# EAGLE schematic esp-module-ou (EAGLE 9.6.2)
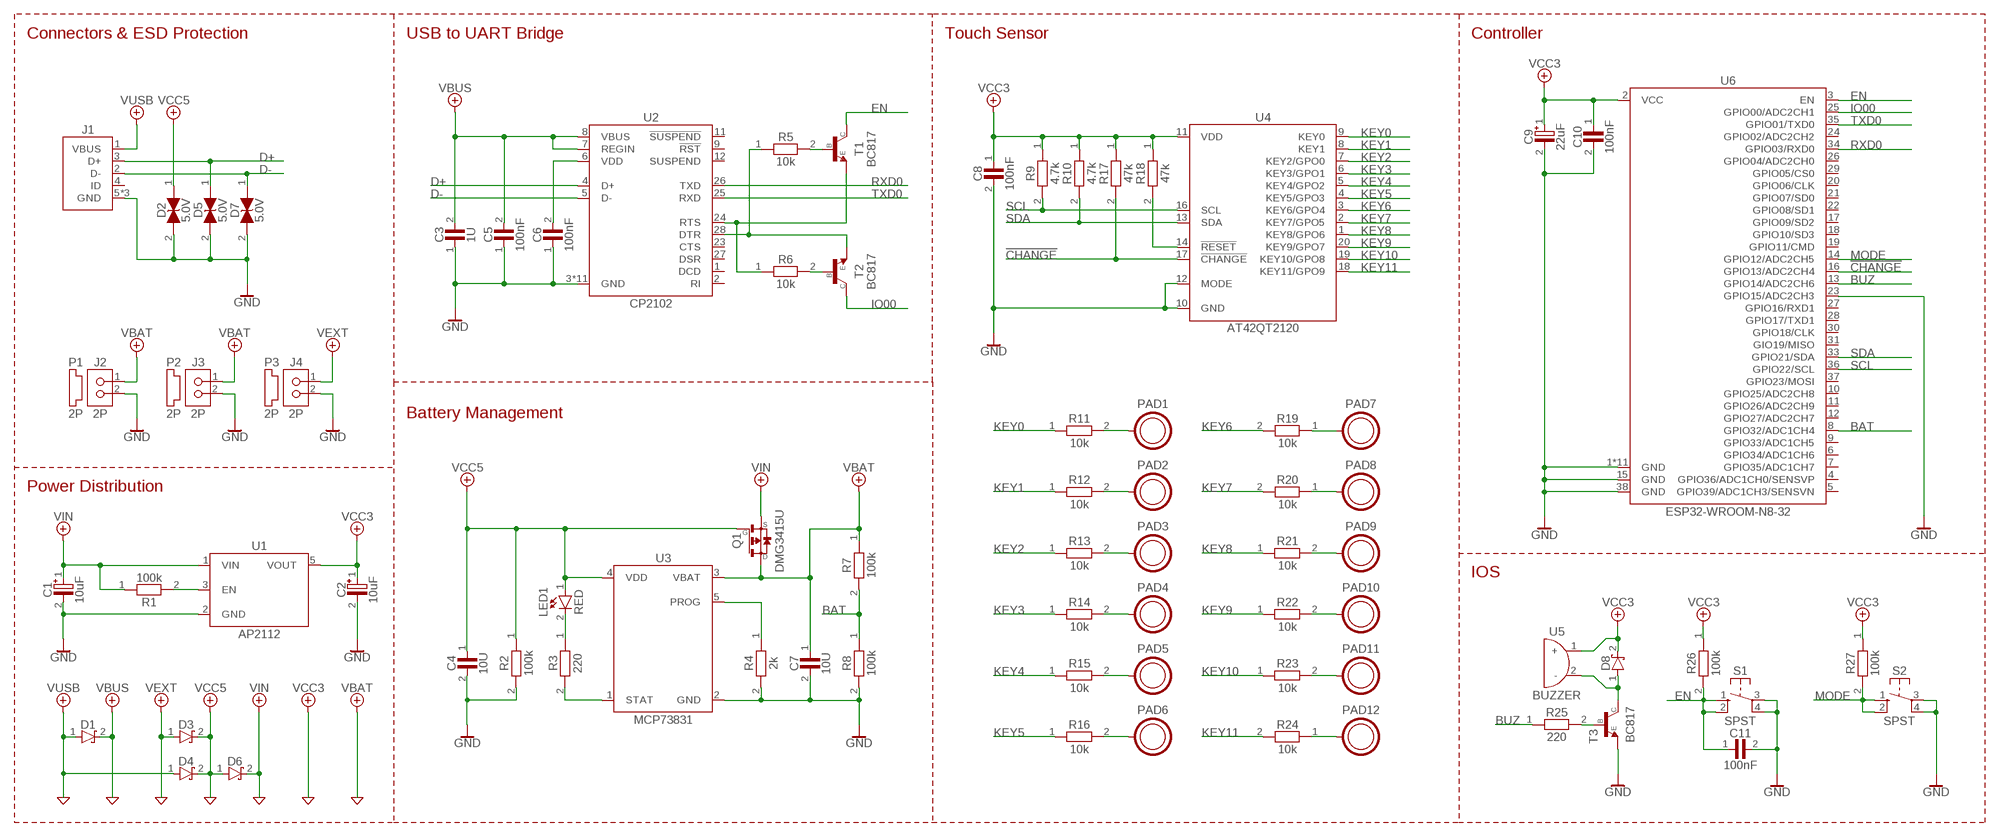
[diagram p0: schematic, sheet 1]

## Parts
C1  10uF  CAPACITOR-TANTALUM-10U-I1206-M3216  [I1206-M3216-D]
C2  10uF  CAPACITOR-TANTALUM-10U-I1206-M3216  [I1206-M3216-D]
C3  1U  CAPACITOR-CERAMIC-1U-I0805-M2012  [I0805-M2012-C]
C4  10U  CAPACITOR-CERAMIC-10U-I0805-M2012  [I0805-M2012-C]
C5  100nF  CAPACITOR-CERAMIC-100N-I0805-M2012  [I0805-M2012-C]
C6  100nF  CAPACITOR-CERAMIC-100N-I0805-M2012  [I0805-M2012-C]
C7  10U  CAPACITOR-CERAMIC-10U-I0805-M2012  [I0805-M2012-C]
C8  100nF  CAPACITOR-CERAMIC-100N-I0805-M2012  [I0805-M2012-C]
C9  22uF  CAPACITOR-TANTALUM-22U-I1206-M3216  [I1206-M3216-D]
C10  100nF  CAPACITOR-CERAMIC-100N-I0805-M2012  [I0805-M2012-C]
C11  100nF  CAPACITOR-CERAMIC-100N-I0805-M2012  [I0805-M2012-C]
D1  30V  SCHOTTKY-30V-SOD-323  [SOD-323]
D2  5.0V  ZENER-BI-5.0V-SOD-523  [SOD-523]
D3  30V  SCHOTTKY-30V-SOD-323  [SOD-323]
D4  30V  SCHOTTKY-30V-SOD-323  [SOD-323]
D5  5.0V  ZENER-BI-5.0V-SOD-523  [SOD-523]
D6  30V  SCHOTTKY-30V-SOD-323  [SOD-323]
D7  5.0V  ZENER-BI-5.0V-SOD-523  [SOD-523]
D8  30V  SCHOTTKY-30V-SOD-323  [SOD-323]
J1  USB-A-MICRO-TOP  [USB-A-MICRO-TOP]
J2  2P  HEADER-02P-1R-S2B-PH-SM4-TB  [JST-S2B-PH-SM4-TB]
J3  2P  HEADER-02P-1R-S2B-PH-SM4-TB  [JST-S2B-PH-SM4-TB]
J4  2P  HEADER-02P-1R-S2B-PH-SM4-TB  [JST-S2B-PH-SM4-TB]
LED1  RED  LED-RED-I0805-M2012  [I0805-M2012-D]
P1  2P  CONNECTOR-02P-1R-PHR  [CONNECTOR-DEFAULT]
P2  2P  CONNECTOR-02P-1R-PHR  [CONNECTOR-DEFAULT]
P3  2P  CONNECTOR-02P-1R-PHR  [CONNECTOR-DEFAULT]
PAD1  QTOUCH  [QTOUCH]
PAD2  QTOUCH  [QTOUCH]
PAD3  QTOUCH  [QTOUCH]
PAD4  QTOUCH  [QTOUCH]
PAD5  QTOUCH  [QTOUCH]
PAD6  QTOUCH  [QTOUCH]
PAD7  QTOUCH  [QTOUCH]
PAD8  QTOUCH  [QTOUCH]
PAD9  QTOUCH  [QTOUCH]
PAD10  QTOUCH  [QTOUCH]
PAD11  QTOUCH  [QTOUCH]
PAD12  QTOUCH  [QTOUCH]
Q1  DMG3415U  MOSFET-P-CHANNEL-20V-4A-SOT-23-3  [SOT-23-3]
R1  100k  RESISTOR-100K-I0805-M2012  [I0805-M2012-R]
R2  100k  RESISTOR-100K-I0805-M2012  [I0805-M2012-R]
R3  220  RESISTOR-220-I0805-M2012  [I0805-M2012-R]
R4  2k  RESISTOR-2K-I0805-M2012  [I0805-M2012-R]
R5  10k  RESISTOR-10K-I0805-M2012  [I0805-M2012-R]
R6  10k  RESISTOR-10K-I0805-M2012  [I0805-M2012-R]
R7  100k  RESISTOR-100K-I0805-M2012  [I0805-M2012-R]
R8  100k  RESISTOR-100K-I0805-M2012  [I0805-M2012-R]
R9  4.7k  RESISTOR-4.7K-I0805-M2012  [I0805-M2012-R]
R10  4.7k  RESISTOR-4.7K-I0805-M2012  [I0805-M2012-R]
R11  10k  RESISTOR-10K-I0805-M2012  [I0805-M2012-R]
R12  10k  RESISTOR-10K-I0805-M2012  [I0805-M2012-R]
R13  10k  RESISTOR-10K-I0805-M2012  [I0805-M2012-R]
R14  10k  RESISTOR-10K-I0805-M2012  [I0805-M2012-R]
R15  10k  RESISTOR-10K-I0805-M2012  [I0805-M2012-R]
R16  10k  RESISTOR-10K-I0805-M2012  [I0805-M2012-R]
R17  47k  RESISTOR-47K-I0805-M2012  [I0805-M2012-R]
R18  47k  RESISTOR-47K-I0805-M2012  [I0805-M2012-R]
R19  10k  RESISTOR-10K-I0805-M2012  [I0805-M2012-R]
R20  10k  RESISTOR-10K-I0805-M2012  [I0805-M2012-R]
R21  10k  RESISTOR-10K-I0805-M2012  [I0805-M2012-R]
R22  10k  RESISTOR-10K-I0805-M2012  [I0805-M2012-R]
R23  10k  RESISTOR-10K-I0805-M2012  [I0805-M2012-R]
R24  10k  RESISTOR-10K-I0805-M2012  [I0805-M2012-R]
R25  220  RESISTOR-220-I0805-M2012  [I0805-M2012-R]
R26  100k  RESISTOR-100K-I0805-M2012  [I0805-M2012-R]
R27  100k  RESISTOR-100K-I0805-M2012  [I0805-M2012-R]
S1  SPST  SWITCH-12V-50MA  [SMD-SW-4]
S2  SPST  SWITCH-12V-50MA  [SMD-SW-4]
T1  BC817  TRANSISTOR-NPN-SOT-23-3  [SOT-23-3]
T2  BC817  TRANSISTOR-NPN-SOT-23-3  [SOT-23-3]
T3  BC817  TRANSISTOR-NPN-SOT-23-3  [SOT-23-3]
U1  AP2112  AP2112-SOT-25-5  [SOT-25-5]
U2  CP2102  CP2102-QFN-28  [QFN-28]
U3  MCP73831  MCP73831-SOT-23-5  [SOT-23-5]
U4  AT42QT2120  AT42QT2120-TSSOP-20  [TSSOP-20]
U5  BUZZER  [SMD-BUZZER]
U6  ESP32-WROOM-N8-32  [ESP32-WROOM-32]

## Nets
!CHANGE: R17.2 U4.17(!CHANGE) U6.16(GPIO13/ADC2CH4)
!RESET: R18.2 U4.14(!RESET)
APEN: R1.2 U1.3(EN)
BAT: R7.2 R8.1 U6.8(GPIO32/ADC1CH4)
BUZ: R25.1 U6.13(GPIO14/ADC2CH6)
BZB: R25.2 T3.1(B)
BZC: D8.1(A) T3.3(C) U5.2(-)
D+: D5.1(A) J1.3(D+) U2.4(D+)
D-: D7.1(A) J1.2(D-) U2.5(D-)
DTR: R5.1 T2.2(E) U2.28(DTR)
DTRT: R5.2 T1.1(B)
EN: C11.1 R26.2 S1.1 S1.2 T1.3(C) U6.3(EN)
GND: C1.2(-) C2.2(-) C3.1 C4.2 C5.1 C6.1 C7.2 C8.2 C9.2(-) C10.2 C11.2 D2.2(C) D5.2(C) D7.2(C) J1.5(GND) J1.6(GND) J1.7(GND) J2.2 J3.2 J4.2 R2.2 R4.2 R8.2 S1.3 S1.4 S2.3 S2.4 T3.2(E) U1.2(GND) U2.3(GND) U2.29(GND) U2.30(GND) U2.31(GND) U2.32(GND) U2.33(GND) U2.34(GND) U2.35(GND) U2.36(GND) U2.37(GND) U2.38(GND) U3.2(GND) U4.10(GND) U4.12(MODE) U6.1(GND) U6.15(GND) U6.23(GPIO15/ADC2CH3) U6.38(GND) U6.39(GND) U6.40(GND) U6.41(GND) U6.42(GND) U6.43(GND) U6.44(GND) U6.45(GND) U6.46(GND) U6.47(GND) U6.48(GND)
IO00: T2.3(C) U6.25(GPIO00/ADC2CH1)
KEY0: R11.1 U4.9(KEY0)
KEY1: R12.1 U4.8(KEY1)
KEY2: R13.1 U4.7(KEY2/GPO0)
KEY3: R14.1 U4.6(KEY3/GPO1)
KEY4: R15.1 U4.5(KEY4/GPO2)
KEY5: R16.1 U4.4(KEY5/GPO3)
KEY6: R19.2 U4.3(KEY6/GPO4)
KEY7: R20.2 U4.2(KEY7/GPO5)
KEY8: R21.1 U4.1(KEY8/GPO6)
KEY9: R22.1 U4.20(KEY9/GPO7)
KEY10: R23.1 U4.19(KEY10/GPO8)
KEY11: R24.2 U4.18(KEY11/GPO9)
MODE: R27.2 S2.1 S2.2 U6.14(GPIO12/ADC2CH5)
PAD00: PAD1.1(PAD) R11.2
PAD01: PAD2.1(PAD) R12.2
PAD02: PAD3.1(PAD) R13.2
PAD03: PAD4.1(PAD) R14.2
PAD04: PAD5.1(PAD) R15.2
PAD05: PAD6.1(PAD) R16.2
PAD06: PAD7.1(PAD) R19.1
PAD07: PAD8.1(PAD) R20.1
PAD08: PAD9.1(PAD) R21.2
PAD09: PAD10.1(PAD) R22.2
PAD10: PAD11.1(PAD) R23.2
PAD11: PAD12.1(PAD) R24.1
PROG: R4.1 U3.5(PROG)
RTS: R6.1 T1.2(E) U2.24(RTS)
RTST: R6.2 T2.1(B)
RXD0: U2.26(TXD) U6.34(GPIO03/RXD0)
SCL: R9.2 U4.16(SCL) U6.36(GPIO22/SCL)
SDA: R10.2 U4.13(SDA) U6.33(GPIO21/SDA)
STAT: R3.2 U3.1(STAT)
STATLED: LED1.2(C) R3.1
TXD0: U2.25(RXD) U6.35(GPIO01/TXD0)
VBAT: C7.1 J2.1 J3.1 Q1.3(D) R7.1 U3.3(VBAT)
VBUS: C3.2 C5.2 D1.2(C) U2.7(REGIN) U2.8(VBUS)
VCC3: C2.1(+) C8.1 C9.1(+) C10.1 D8.2(C) R9.1 R10.1 R17.1 R18.1 R26.1 R27.1 U1.5(VOUT) U4.11(VDD) U5.1(+) U6.2(VCC)
VCC5: C4.1 D2.1(A) D3.2(C) D4.2(C) D6.1(A) LED1.1(A) Q1.1(G) R2.1 U3.4(VDD)
VDD: C6.2 U2.6(VDD)
VEXT: D3.1(A) J4.1
VIN: C1.1(+) D6.2(C) Q1.2(S) R1.1 U1.1(VIN)
VUSB: D1.1(A) D4.1(A) J1.1(VBUS)
Unconnected: J1.4(ID) U2.1(DCD) U2.2(RI) U2.9(!RST) U2.11(!SUSPEND) U2.12(SUSPEND) U2.23(CTS) U2.27(DSR) U6.4(GPIO36/ADC1CH0/SENSVP) U6.5(GPIO39/ADC1CH3/SENSVN) U6.6(GPIO34/ADC1CH6) U6.7(GPIO35/ADC1CH7) U6.9(GPIO33/ADC1CH5) U6.10(GPIO25/ADC2CH8) U6.11(GPIO26/ADC2CH9) U6.12(GPIO27/ADC2CH7) U6.17(GPIO09/SD2) U6.18(GPIO10/SD3) U6.19(GPIO11/CMD) U6.20(GPIO06/CLK) U6.21(GPIO07/SD0) U6.22(GPIO08/SD1) U6.24(GPIO02/ADC2CH2) U6.26(GPIO04/ADC2CH0) U6.27(GPIO16/RXD1) U6.28(GPIO17/TXD1) U6.29(GPIO05/CS0) U6.30(GPIO18/CLK) U6.31(GIO19/MISO) U6.37(GPIO23/MOSI)

## Notes on the sheet
- Connectors & ESD Protection | USB to UART Bridge | Touch Sensor | Controller
- Battery Management
- Power Distribution
- IOS

## Library data of the parts
C1 C2 = deiring-components:CAPACITOR-TANTALUM: Capacitors Tantalum; LCSC: C7171; MF: Kyocera AVX; MPN: TAJA106K016RNJ; VOLTAGE: 16V
C3 = deiring-components:CAPACITOR-CERAMIC: Capacitors Multilayer Ceramic; LCSC: C215803; MF: FH (Guangdong Fenghua Advanced Tech); MPN: 0805B105K500NT; TOLERANCE: 10%; VOLTAGE: 50V
C4 C7 = deiring-components:CAPACITOR-CERAMIC: Capacitors Multilayer Ceramic; LCSC: C15850; MF: Samsung Electro-Mechanics; MPN: CL21A106KAYNNNE; TOLERANCE: 10%; VOLTAGE: 25V
C5 C6 C8 C10 C11 = deiring-components:CAPACITOR-CERAMIC: Capacitors Multilayer Ceramic; LCSC: C38141; MF: FH (Guangdong Fenghua Advanced Tech); MPN: 0805B104K500NT; TOLERANCE: 10%; VOLTAGE: 50V
C9 = deiring-components:CAPACITOR-TANTALUM: Capacitors Tantalum; LCSC: C11366; MF: Kyocera AVX; MPN: TAJA226K010RNJ; VOLTAGE: 10V
D1 D3 D4 D6 D8 = deiring-components:SCHOTTKY: Shottky Barrier Diodes; LCSC: C124187; MF: Diodes Incorporated; MPN: BAT760-7
D2 D5 D7 = deiring-components:ZENER-BI: Zener Diode; LCSC: C383211; MF: LRC; MPN: LESD5D5.0CT1G
J1 = deiring-components:USB-A: USB Micro-B Connector; LCSC: C437032; MF: XKB Connectivity; MPN: U255-051N-4BH70-FS
J2-J4 = deiring-components:HEADER-02P-1R: Header 2 Pin 1 Row; LCSC: C295747; MF: JST Sales America; MPN: S2B-PH-SM4-TB(LF)(SN)
LED1 = deiring-components:LED: Light Emitting Diodes; LCSC: C84256; MF: Foshan NationStar Optoelectronics; MPN: FC-2012HRK-620D
P1-P3 = deiring-components:CONNECTOR-02P-1R: Plug 2 Pin 1 Row; LCSC: C3195190; MF: JST Sales America; MPN: PHR-2
PAD1-PAD12 = deiring-components:QTOUCH: Plane Pad
Q1 = deiring-components:MOSFET-P-CHANNEL: P-Channel MOSFET; CURRENT: 4A; LCSC: C96616; MF: Diodes Incorporated; MPN: DMG3415U-7; VOLTAGE: 20V
R1 R2 R7 R8 R26 R27 = deiring-components:RESISTOR: Chip Resistor; LCSC: C149504; MF: UNI-ROYAL(Uniroyal Elec); MPN: 0805W8F1003T5E; WATTAGE: 1/8W
R3 R25 = deiring-components:RESISTOR: Chip Resistor; LCSC: C17557; MF: UNI-ROYAL(Uniroyal Elec); MPN: 0805W8F2200T5E; WATTAGE: 1/8W
R4 = deiring-components:RESISTOR: Chip Resistor; LCSC: C17604; MF: UNI-ROYAL(Uniroyal Elec); MPN: 0805W8F2001T5E; WATTAGE: 1/8W
R5 R6 R11-R16 R19-R24 = deiring-components:RESISTOR: Chip Resistor; LCSC: C17414; MF: UNI-ROYAL(Uniroyal Elec); MPN: 0805W8F1002T5E; WATTAGE: 1/8W
R9 R10 = deiring-components:RESISTOR: Chip Resistor; LCSC: C17673; MF: UNI-ROYAL(Uniroyal Elec); MPN: 0805W8F4701T5E; WATTAGE: 1/8W
R17 R18 = deiring-components:RESISTOR: Chip Resistor; LCSC: C17713; MF: UNI-ROYAL(Uniroyal Elec); MPN: 0805W8F4702T5E; WATTAGE: 1/8W
S1 S2 = deiring-components:SWITCH: Tactile Switch SPST; LCSC: C318884; MF: XKB Enterprise; MPN: TS-1187A-B-A-B; VOLTAGE: 12V
T1-T3 = deiring-components:TRANSISTOR-NPN: NPN General-Ourpose Transistors; LCSC: C52801; MF: Nexperia; MPN: BC817-40,215
U1 = deiring-components:AP2112: Linear Voltage Regulators; LCSC: C3021085; MF: TECH PUBLIC; MPN: TPAP2112K-3.3TRG1
U2 = deiring-components:CP2102: Single-Chip USB to UART Bridge; LCSC: C6568; MF: SILICON LABS; MPN: CP2102-GMR
U3 = deiring-components:MCP73831: Miniature Single-Cell, Fully Integrated Li-Ion, Li-Polymer Charge Management Controllers; LCSC: C14879; MF: Microchip Tech; MPN: MCP73831T-2ATI/OT
U4 = deiring-components:AT42QT2120: Capacitive Touch Sensor; LCSC: C1522278; MF: Microchip Tech; MPN: AT42QT2120-XU
U5 = deiring-components:BUZZER: Externally Driven Buzzer; LCSC: C95299; MF: MLT-7525; MPN: Jiangsu Huaneng Elec
U6 = deiring-components:ESP32-WROOM: ESP WROOM 32; LCSC: C529582; MF: Espressif Systems; MPN: ESP32-WROOM-32-N8; VALUES: ESP32